# Altium schematic sheet CM_FPGA_B4-5.SchDoc
size Tabloid; SheetNumber: 6; SheetTotal: 14; Sheet_Name: CM_FPGA_B4-5; Size: 11x17
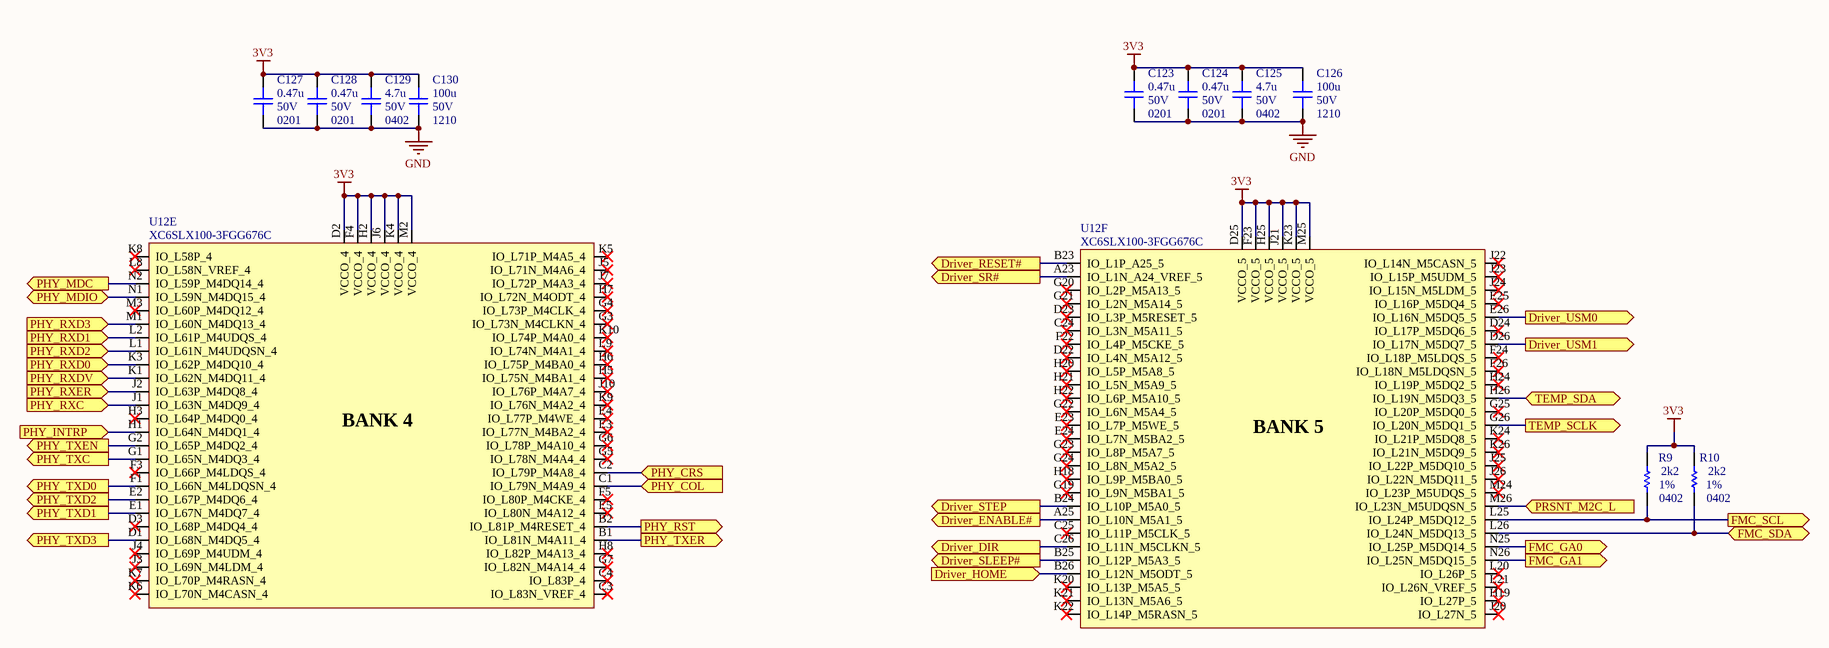
[diagram p0: CM_FPGA_B4-5.SchDoc]

## Parts
C123  value 0.47u  Voltage: 50V  Package: 0201  [CAP_0201]  (hidden comment: CAP - 0201)
C124  value 0.47u  Voltage: 50V  Package: 0201  [CAP_0201]  (hidden comment: CAP - 0201)
C125  value 4.7u  Voltage: 50V  Package: 0402  [CAP_0402]  (hidden comment: CAP - 0402)
C126  value 100u  Voltage: 50V  Package: 1210  [CAP_1210]  (hidden comment: CAP - 1210)
C127  value 0.47u  Voltage: 50V  Package: 0201  [CAP_0201]  (hidden comment: CAP - 0201)
C128  value 0.47u  Voltage: 50V  Package: 0201  [CAP_0201]  (hidden comment: CAP - 0201)
C129  value 4.7u  Voltage: 50V  Package: 0402  [CAP_0402]  (hidden comment: CAP - 0402)
C130  value 100u  Voltage: 50V  Package: 1210  [CAP_1210]  (hidden comment: CAP - 1210)
R9  value 2k2  Package: 0402  Precision: 1%  [RES_0402]  (hidden comment: RES - 0402)
R10  value 2k2  Package: 0402  Precision: 1%  [RES_0402]  (hidden comment: RES - 0402)
U12  XC6SLX100-3FGG676C  [FPGA_XILINX_FGG676]  (parts E,F of 10)

## Ports
Driver_DIR (out), Driver_ENABLE# (out), Driver_HOME (in), Driver_RESET# (out), Driver_SLEEP# (out), Driver_SR# (out), Driver_STEP (out), Driver_USM0 (out), Driver_USM1 (out), FMC_GA0 (out), FMC_GA1 (out), FMC_SCL (out), FMC_SDA (bidir), PHY_COL (in), PHY_CRS (in), PHY_INTRP (in), PHY_MDC (out), PHY_MDIO (bidir), PHY_RST (out), PHY_RXC (in), PHY_RXD0 (in), PHY_RXD1 (in), PHY_RXD2 (in), PHY_RXD3 (in), PHY_RXDV (in), PHY_RXER (in), PHY_TXC (out), PHY_TXD0 (out), PHY_TXD1 (out), PHY_TXD2 (out), PHY_TXD3 (out), PHY_TXEN (out), PHY_TXER (out), PRSNT_M2C_L (in), TEMP_SCLK (out), TEMP_SDA (bidir)

## Nets
3V3: C123.2 C124.2 C125.2 C126.2 C127.2 C128.2 C129.2 C130.2 R9.2 R10.2 U12.D2(VCCO_4) U12.D25(VCCO_5) U12.F4(VCCO_4) U12.F23(VCCO_5) U12.H2(VCCO_4) U12.H25(VCCO_5) U12.J6(VCCO_4) U12.J21(VCCO_5) U12.K4(VCCO_4) U12.K23(VCCO_5) U12.M2(VCCO_4) U12.M25(VCCO_5)
GND: C123.1 C124.1 C125.1 C126.1 C127.1 C128.1 C129.1 C130.1
Driver_DIR: U12.C26(IO_L11N_M5CLKN_5) ; port Driver_DIR
Driver_ENABLE#: U12.A25(IO_L10N_M5A1_5) ; port Driver_ENABLE#
Driver_HOME: U12.B26(IO_L12N_M5ODT_5) ; port Driver_HOME
Driver_RESET#: U12.B23(IO_L1P_A25_5) ; port Driver_RESET#
Driver_SLEEP#: U12.B25(IO_L12P_M5A3_5) ; port Driver_SLEEP#
Driver_SR#: U12.A23(IO_L1N_A24_VREF_5) ; port Driver_SR#
Driver_STEP: U12.B24(IO_L10P_M5A0_5) ; port Driver_STEP
Driver_USM0: U12.E26(IO_L16N_M5DQ5_5) ; port Driver_USM0
Driver_USM1: U12.D26(IO_L17N_M5DQ7_5) ; port Driver_USM1
FMC_GA0: U12.N25(IO_L25P_M5DQ14_5) ; port FMC_GA0
FMC_GA1: U12.N26(IO_L25N_M5DQ15_5) ; port FMC_GA1
FMC_SCL: R9.1 U12.L25(IO_L24P_M5DQ12_5) ; port FMC_SCL
FMC_SDA: R10.1 U12.L26(IO_L24N_M5DQ13_5) ; port FMC_SDA
PHY_COL: U12.C1(IO_L79N_M4A9_4) ; port PHY_COL
PHY_CRS: U12.C2(IO_L79P_M4A8_4) ; port PHY_CRS
PHY_INTRP: U12.H1(IO_L64N_M4DQ1_4) ; port PHY_INTRP
PHY_MDC: U12.N2(IO_L59P_M4DQ14_4) ; port PHY_MDC
PHY_MDIO: U12.N1(IO_L59N_M4DQ15_4) ; port PHY_MDIO
PHY_RST: U12.B2(IO_L81P_M4RESET_4) ; port PHY_RST
PHY_RXC: U12.J1(IO_L63N_M4DQ9_4) ; port PHY_RXC
PHY_RXD0: U12.K3(IO_L62P_M4DQ10_4) ; port PHY_RXD0
PHY_RXD1: U12.L2(IO_L61P_M4UDQS_4) ; port PHY_RXD1
PHY_RXD2: U12.L1(IO_L61N_M4UDQSN_4) ; port PHY_RXD2
PHY_RXD3: U12.M1(IO_L60N_M4DQ13_4) ; port PHY_RXD3
PHY_RXDV: U12.K1(IO_L62N_M4DQ11_4) ; port PHY_RXDV
PHY_RXER: U12.J2(IO_L63P_M4DQ8_4) ; port PHY_RXER
PHY_TXC: U12.G1(IO_L65N_M4DQ3_4) ; port PHY_TXC
PHY_TXD0: U12.F1(IO_L66N_M4LDQSN_4) ; port PHY_TXD0
PHY_TXD1: U12.E1(IO_L67N_M4DQ7_4) ; port PHY_TXD1
PHY_TXD2: U12.E2(IO_L67P_M4DQ6_4) ; port PHY_TXD2
PHY_TXD3: U12.D1(IO_L68N_M4DQ5_4) ; port PHY_TXD3
PHY_TXEN: U12.G2(IO_L65P_M4DQ2_4) ; port PHY_TXEN
PHY_TXER: U12.B1(IO_L81N_M4A11_4) ; port PHY_TXER
PRSNT_M2C_L: U12.M26(IO_L23N_M5UDQSN_5) ; port PRSNT_M2C_L
TEMP_SCLK: U12.G26(IO_L20N_M5DQ1_5) ; port TEMP_SCLK
TEMP_SDA: U12.H26(IO_L19N_M5DQ3_5) ; port TEMP_SDA

Not connected (* = marked no-connect by the designer): U12 C3(IO_L83N_VREF_4)* C4(IO_L83P_4)* C24(IO_L3N_M5A11_5)* C25(IO_L11P_M5CLK_5)* D3(IO_L68P_M4DQ4_4)* D22(IO_L4N_M5A12_5)* D23(IO_L3P_M5RESET_5)* D24(IO_L17P_M5DQ6_5)* E3(IO_L77N_M4BA2_4)* E4(IO_L77P_M4WE_4)* E5(IO_L80N_M4A12_4)* E23(IO_L7P_M5WE_5)* E24(IO_L7N_M5BA2_5)* E25(IO_L16P_M5DQ4_5)* F3(IO_L66P_M4LDQS_4)* F5(IO_L80P_M4CKE_4)* F22(IO_L4P_M5CKE_5)* F24(IO_L18P_M5LDQS_5)* F26(IO_L18N_M5LDQSN_5)* G3(IO_L73N_M4CLKN_4)* G4(IO_L73P_M4CLK_4)* G5(IO_L78N_M4A4_4)* G6(IO_L78P_M4A10_4)* G7(IO_L82N_M4A14_4)* G19(IO_L9N_M5BA1_5)* G20(IO_L2P_M5A13_5)* G21(IO_L2N_M5A14_5)* G22(IO_L6N_M5A4_5)* G23(IO_L8P_M5A7_5)* G24(IO_L8N_M5A2_5)* G25(IO_L20P_M5DQ0_5)* H3(IO_L64P_M4DQ0_4)* H5(IO_L75N_M4BA1_4)* H6(IO_L75P_M4BA0_4)* H7(IO_L72N_M4ODT_4)* H8(IO_L82P_M4A13_4)* H18(IO_L9P_M5BA0_5)* H19(IO_L27P_5)* H20(IO_L5P_M5A8_5)* H21(IO_L5N_M5A9_5)* H22(IO_L6P_M5A10_5)* H24(IO_L19P_M5DQ2_5)* J3(IO_L69N_M4LDM_4)* J4(IO_L69P_M4UDM_4)* J5(IO_L71N_M4A6_4)* J7(IO_L72P_M4A3_4)* J10(IO_L76P_M4A7_4)* J20(IO_L27N_5)* J22(IO_L14N_M5CASN_5)* J23(IO_L15P_M5UDM_5)* J24(IO_L15N_M5LDM_5)* J25(IO_L22P_M5DQ10_5)* J26(IO_L22N_M5DQ11_5)* K5(IO_L71P_M4A5_4)* K6(IO_L70N_M4CASN_4)* K7(IO_L70P_M4RASN_4)* K8(IO_L58P_4)* K9(IO_L76N_M4A2_4)* K10(IO_L74P_M4A0_4)* K20(IO_L13P_M5A5_5)* K21(IO_L13N_M5A6_5)* K22(IO_L14P_M5RASN_5)* K24(IO_L21P_M5DQ8_5)* K26(IO_L21N_M5DQ9_5)* L8(IO_L58N_VREF_4)* L9(IO_L74N_M4A1_4)* L20(IO_L26P_5)* L21(IO_L26N_VREF_5)* M3(IO_L60P_M4DQ12_4)* M24(IO_L23P_M5UDQS_5)*

## Notes on the sheet
- Sheet Name
- Project Title
- Global Project
- Size
- Group
- Revision
- Date
- Sheet
- of
- Filename
- Designers
- (in symbol FPGA_XC6SLX100-3FGG676C, part E) BANK 4
- (in symbol FPGA_XC6SLX100-3FGG676C, part F) BANK 5

## Library data of the parts
C123 C124 C127 C128 = CAP - 0201: Precision: 10%; Current: *; CreatedBy: Jonathan Bouchard; Power: *
C125 C129 = CAP - 0402: Precision: 10%; Current: *; CreatedBy: Jonathan Bouchard; Power: *
C126 C130 = CAP - 1210: Precision: 10%; Current: *; CreatedBy: Jonathan Bouchard; Power: *
R9 R10 = RES - 0402: Voltage: 50V; Power: 1/16W; Current: *; CreatedBy: Jonathan Bouchard
U12 = FPGA_XC6SLX100-3FGG676C: FPGA - XILINX SPARTAN 6 480 I/O - BGA-676; Voltage: 1.14 V ~ 1.26 V; Current: *; Power: *; Mfg: Xilinx; Mfg Part Number: XC6SLX100-3FGG676C; HelpURL: https://www.xilinx.com/support/documentation/data_sheets/ds162.pdf; CreatedBy: Jonathan Bouchard; Temperature: 0°C ~ 85°C (TJ); Value: *; Precision: *; Package: BGA-676; Supplier 1: Digikey; Supplier Part Number 1: 122-1760-ND